# EAGLE design linistep1mod (EAGLE 6.4)

## Sheet 1 of 2
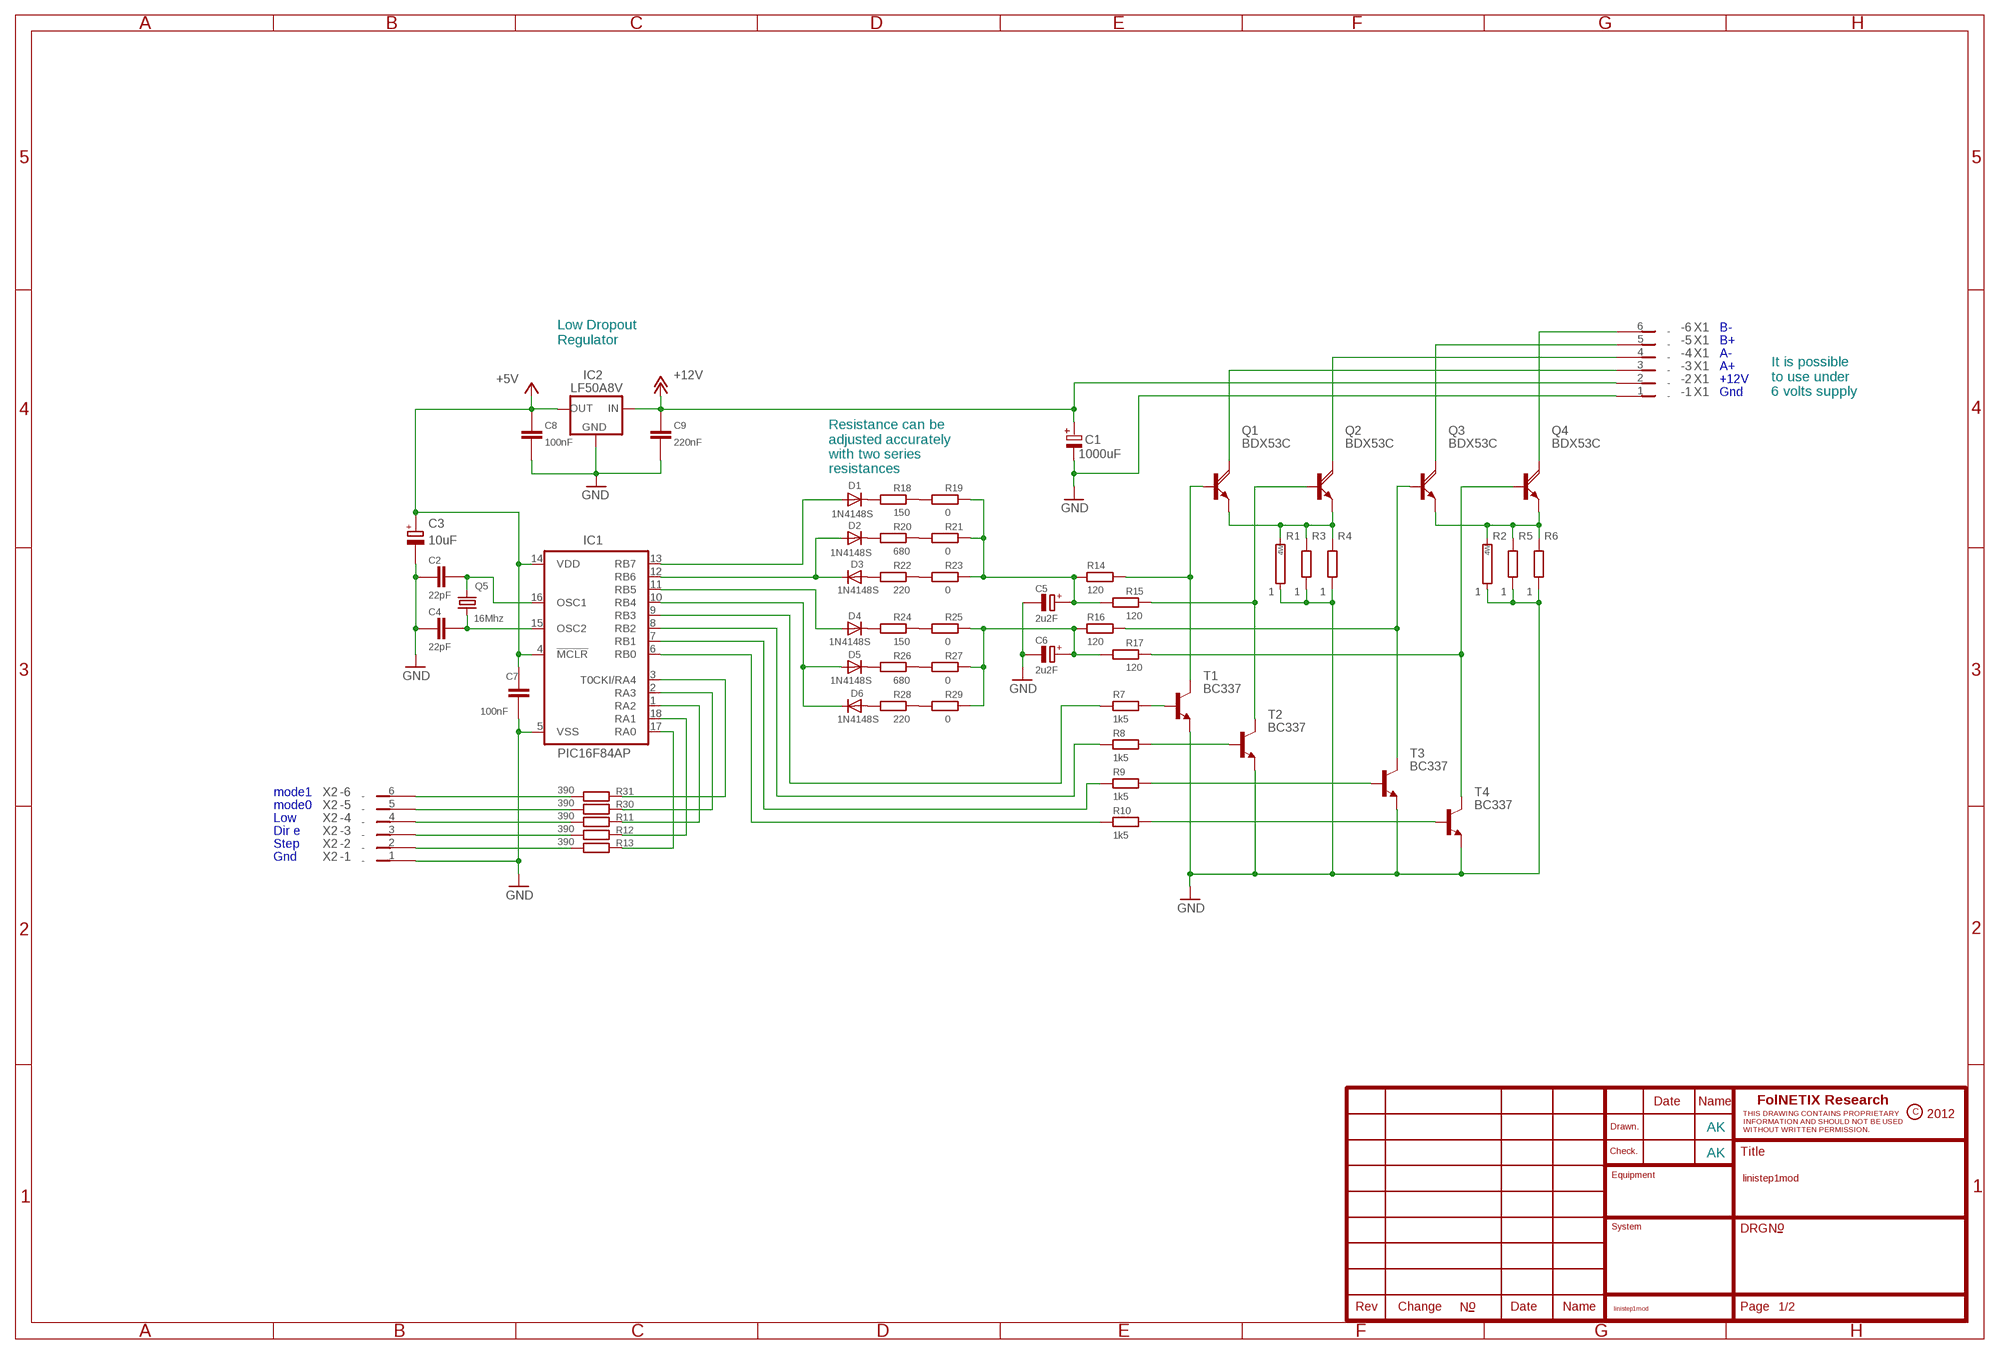
[diagram p0: schematic, sheet 1]

### Parts
C1  1000uF  E5-10,5  [E5-10,5]
C2  22pF  CAPACITOR_0805  [CAPC2012X145AN]
C3  10uF  POLARISED_B_CASE  [CAPMP3528X210N]
C4  22pF  CAPACITOR_0805  [CAPC2012X145AN]
C5  2u2F  POLARISED_A_CASE  [CAPMP3216X180N]
C6  2u2F  POLARISED_A_CASE  [CAPMP3216X180N]
C7  100nF  CAPACITOR_0805  [CAPC2012X145AN]
C8  100nF  CAPACITOR_0805  [CAPC2012X145AN]
C9  220nF  CAPACITOR_1210  [CAPC3225X168N]
D1  1N4148S  [DO35-7A]
D2  1N4148S  [DO35-7A]
D3  1N4148S  [DO35-7A]
D4  1N4148S  [DO35-7A]
D5  1N4148S  [DO35-7A]
D6  1N4148S  [DO35-7A]
IC1  PIC16F84AP  [DIL18]
IC2  LF50A8V  78XXL  [78XXL]
Q1  BDX53C  TIP120S  [TO220AHS]
Q2  BDX53C  TIP120S  [TO220AHS]
Q3  BDX53C  TIP120S  [TO220AHS]
Q4  BDX53C  TIP120S  [TO220AHS]
Q5  16Mhz  HC49/S  [HC49/S]
R1  1  206A  [206A]
R2  1  206A  [206A]
R3  1  0411/12  [0411/12]
R4  1  0411/12  [0411/12]
R5  1  0411/12  [0411/12]
R6  1  0411/12  [0411/12]
R7  1k5  RESISTOR_1206  [RESC3115X70N]
R8  1k5  RESISTOR_1206  [RESC3115X70N]
R9  1k5  RESISTOR_1206  [RESC3115X70N]
R10  1k5  RESISTOR_1206  [RESC3115X70N]
R11  390  RESISTOR_1206  [RESC3115X70N]
R12  390  RESISTOR_1206  [RESC3115X70N]
R13  390  RESISTOR_1206  [RESC3115X70N]
R14  120  RESISTOR_1206  [RESC3115X70N]
R15  120  RESISTOR_1206  [RESC3115X70N]
R16  120  RESISTOR_1206  [RESC3115X70N]
R17  120  RESISTOR_1206  [RESC3115X70N]
R18  150  RESISTOR_1206  [RESC3115X70N]
R19  0  RESISTOR_1206  [RESC3115X70N]
R20  680  RESISTOR_1206  [RESC3115X70N]
R21  0  RESISTOR_1206  [RESC3115X70N]
R22  220  RESISTOR_1206  [RESC3115X70N]
R23  0  RESISTOR_1206  [RESC3115X70N]
R24  150  RESISTOR_1206  [RESC3115X70N]
R25  0  RESISTOR_1206  [RESC3115X70N]
R26  680  RESISTOR_1206  [RESC3115X70N]
R27  0  RESISTOR_1206  [RESC3115X70N]
R28  220  RESISTOR_1206  [RESC3115X70N]
R29  0  RESISTOR_1206  [RESC3115X70N]
R30  390  RESISTOR_1206  [RESC3115X70N]
R31  390  RESISTOR_1206  [RESC3115X70N]
T1  BC337  [TO92]
T2  BC337  [TO92]
T3  BC337  [TO92]
T4  BC337  [TO92]
X1  RIACON-6  [RIACON-6]
X2  RIACON-6  [RIACON-6]

### Nets
+5V [power]: C3.+ C7.2 C8.2 IC1.4(!MCLR) IC1.14(VDD) IC2.OUT
+12V [power]: C1.+ C9.2 IC2.IN X1.2
GND [power]: C1.- C2.1 C3.- C4.1 C5.- C6.- C7.1 C8.1 C9.1 IC1.5(VSS) IC2.GND R1.1 R2.1 R3.1 R4.1 R5.1 R6.1 T1.1(E) T2.1(E) T3.1(E) T4.1(E) X1.1 X2.1
N$1 [power]: Q1.E Q2.E R1.2 R3.2 R4.2
N$2: D3.A R22.1
N$3: D2.C R20.1
N$4 [digital]: R7.2 T1.2(B)
N$5 [power]: Q3.E Q4.E R2.2 R5.2 R6.2
N$6 [digital]: R8.2 T2.2(B)
N$7: R31.1 X2.6
N$8 [digital]: R9.2 T3.2(B)
N$9 [digital]: Q4.B R17.2 T4.3(C)
N$10 [digital]: Q3.B R16.2 T3.3(C)
N$11 [digital]: Q2.B R15.2 T2.3(C)
N$12 [digital]: Q1.B R14.2 T1.3(C)
N$13 [digital]: R10.2 T4.2(B)
N$14 [power]: Q4.C X1.6
N$15 [power]: Q3.C X1.5
N$16 [power]: Q2.C X1.4
N$17 [power]: Q1.C X1.3
N$18: D1.C R18.1
N$19: D4.C R24.1
N$20: R30.1 X2.5
N$21: R18.2 R19.1
N$22: R20.2 R21.1
N$23: R22.2 R23.1
N$24: R24.2 R25.1
N$25: D5.C R26.1
N$26: D6.A R28.1
N$27 [digital]: C6.+ R16.1 R17.1 R25.2 R27.2 R29.2
N$28 [digital]: C5.+ R14.1 R15.1 R19.2 R21.2 R23.2
N$29: R26.2 R27.1
N$30: R28.2 R29.1
N$31: R11.1 X2.4
N$32 [digital]: D5.A D6.C IC1.10(RB4)
N$33: C2.2 IC1.16(OSC1) Q5.2
N$34: R12.1 X2.3
N$35: R13.1 X2.2
N$37 [digital]: IC1.6(RB0) R10.1
N$38 [digital]: IC1.7(RB1) R9.1
N$39 [digital]: IC1.8(RB2) R8.1
N$40 [digital]: IC1.9(RB3) R7.1
N$41 [digital]: D4.A IC1.11(RB5)
N$42: C4.2 IC1.15(OSC2) Q5.1
N$43 [power]: D1.A IC1.13(RB7)
N$44 [digital]: IC1.3(T0CKI/RA4) R31.2
N$45 [digital]: IC1.2(RA3) R30.2
N$46 [digital]: IC1.1(RA2) R11.2
N$47 [digital]: IC1.18(RA1) R12.2
N$48 [digital]: IC1.17(RA0) R13.2
N$50 [digital]: D2.A D3.C IC1.12(RB6)

### Notes on the sheet
- B-
- Low Dropout
  Regulator
- B+
- A-
- A+
- +12V
- Gnd
- It is possible
  to use under
  6 volts supply
- Resistance can be
  adjusted accurately
  with two series
  resistances
- mode1
- mode0
- Low
- Dir e
- Step
- Gnd
- AK
- AK

## Sheet 2 of 2
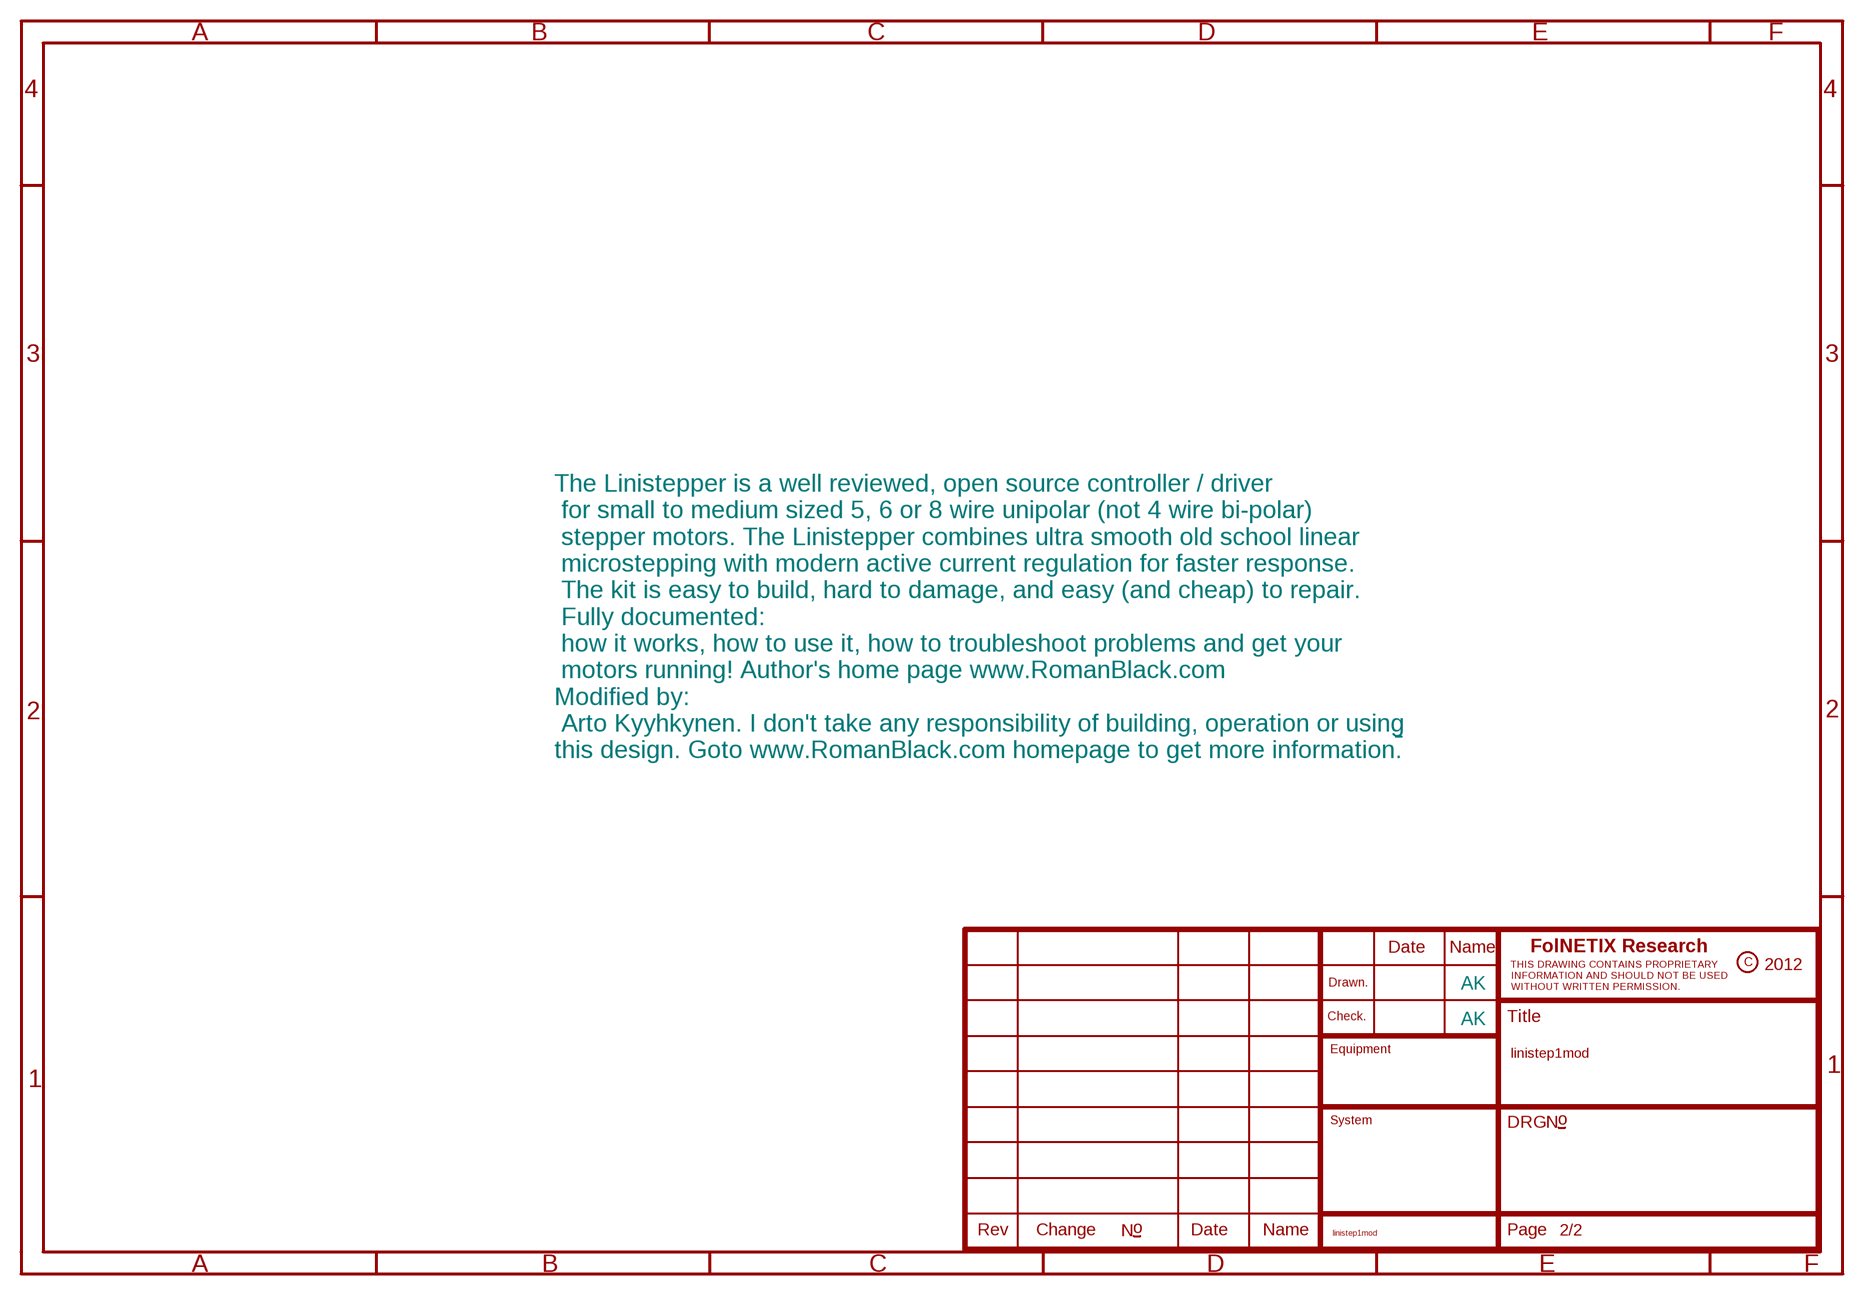
[diagram p1: schematic, sheet 2]

### Notes on the sheet
- The Linistepper is a well reviewed, open source controller / driver
   for small to medium sized 5, 6 or 8 wire unipolar (not 4 wire bi-polar)
   stepper motors. The Linistepper combines ultra smooth old school linear
   microstepping with modern active current regulation for faster response.
   The kit is easy to build, hard to damage, and easy (and cheap) to repair.
   Fully documented:
   how it works, how to use it, how to troubleshoot problems and get your
   motors running! Author's home page www.RomanBlack.com
  Modified by:
   Arto Kyyhkynen. I don't take any responsibility of building, operation or using
  this design. Goto www.RomanBlack.com homepage to get more information!.
- AK
- AK

## Library data of the parts
C1 = polcap:E5-10,5
C2 C4 C7-C9 = ipc-7351-capacitor:CAPACITOR_
C3 C5 C6 = ipc-7351-capacitor:POLARISED_
D1-D6 = diode:1N4148: DIODE high speed (Philips)
IC1 = microchip2:PIC16F8*: MICROCONTROLLER 8-Bit PIC16F8X Family - CMOS Flash/EEPROM Pin Compatible : PIC16F83, PIC16CR83, PIC16F84A, PIC16CR84 see also PIC16C*
IC2 = v-reg-2:78XXL: VOLTAGE REGULATOR
Q1-Q4 = user1:TIP120: NPN DARLINGTON TRANSISTOR
Q5 = quartz:HC49/S
R1 R2 = r-pwr:206A
R3-R6 = Resistor:0411/12
R7-R31 = ipc-7351-resistor:RESISTOR_
T1-T4 = transistor:BC337: NPN TRANSISTOR
X1 X2 = con-riacon2:RIACON-6

## Net classes
1 digital: width 0.254 mm, drill 1.016 mm, clearance 0.254 mm
2 power: width 1.016 mm, drill 1.016 mm, clearance 0.508 mm

## Board
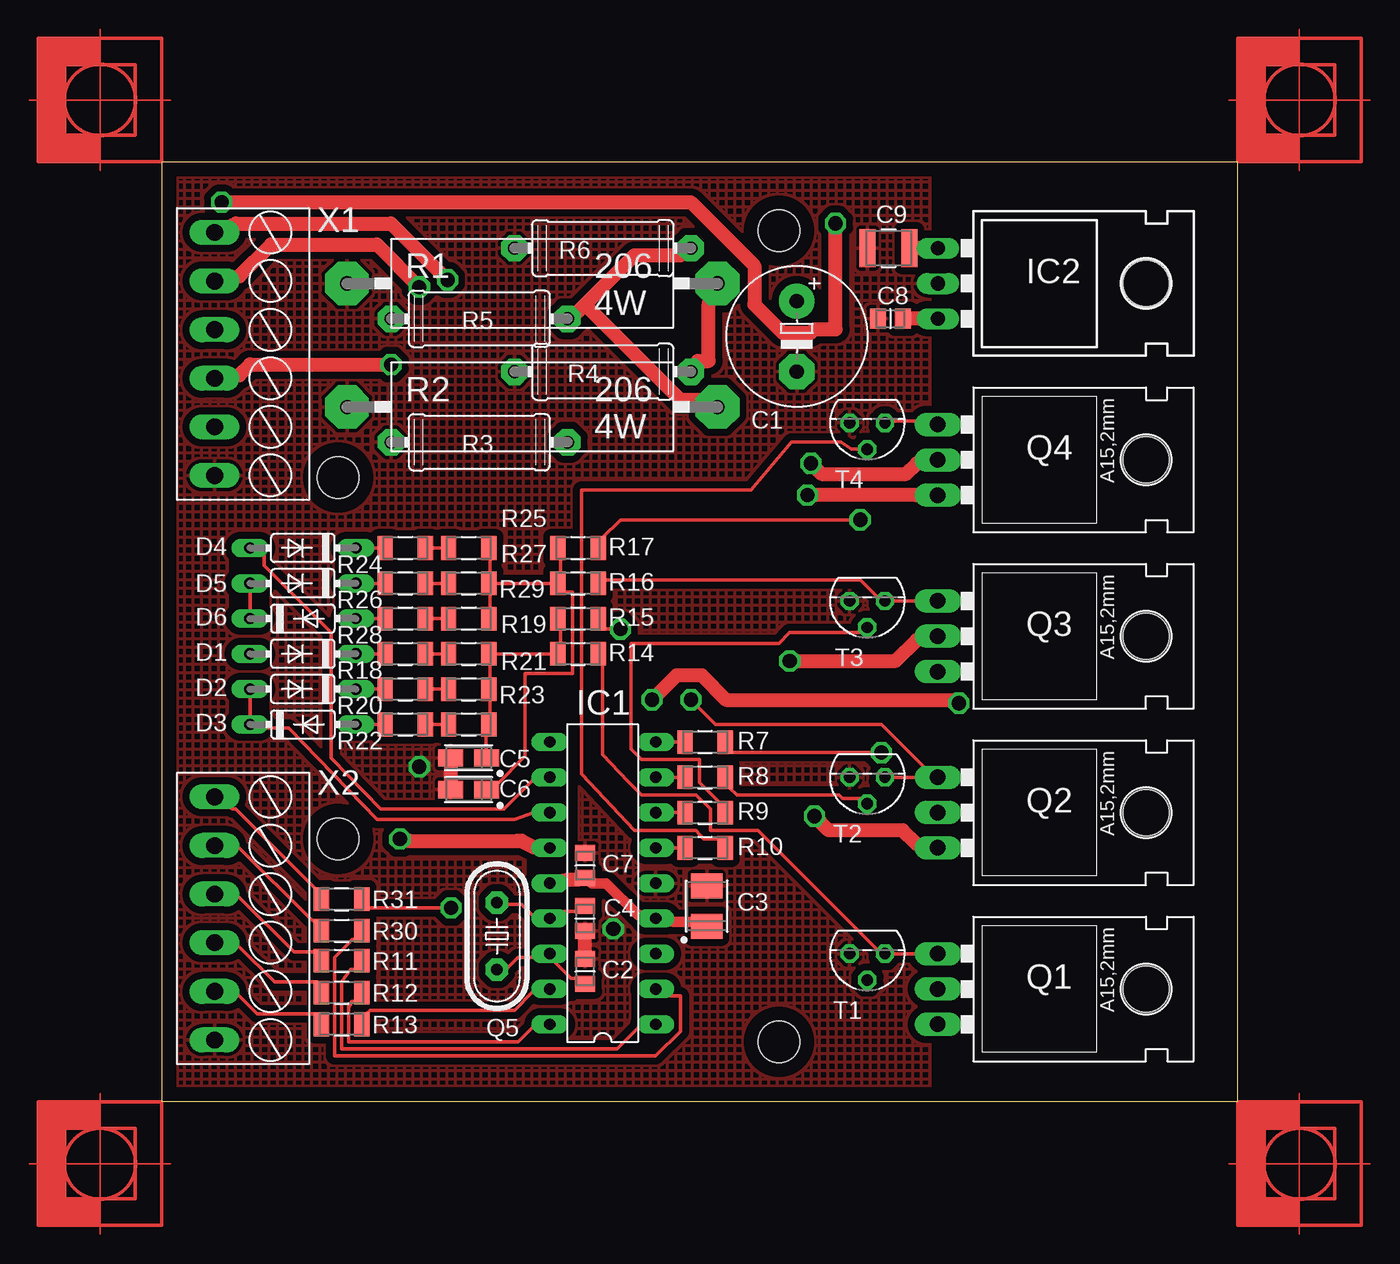
[diagram p2: board, top side]
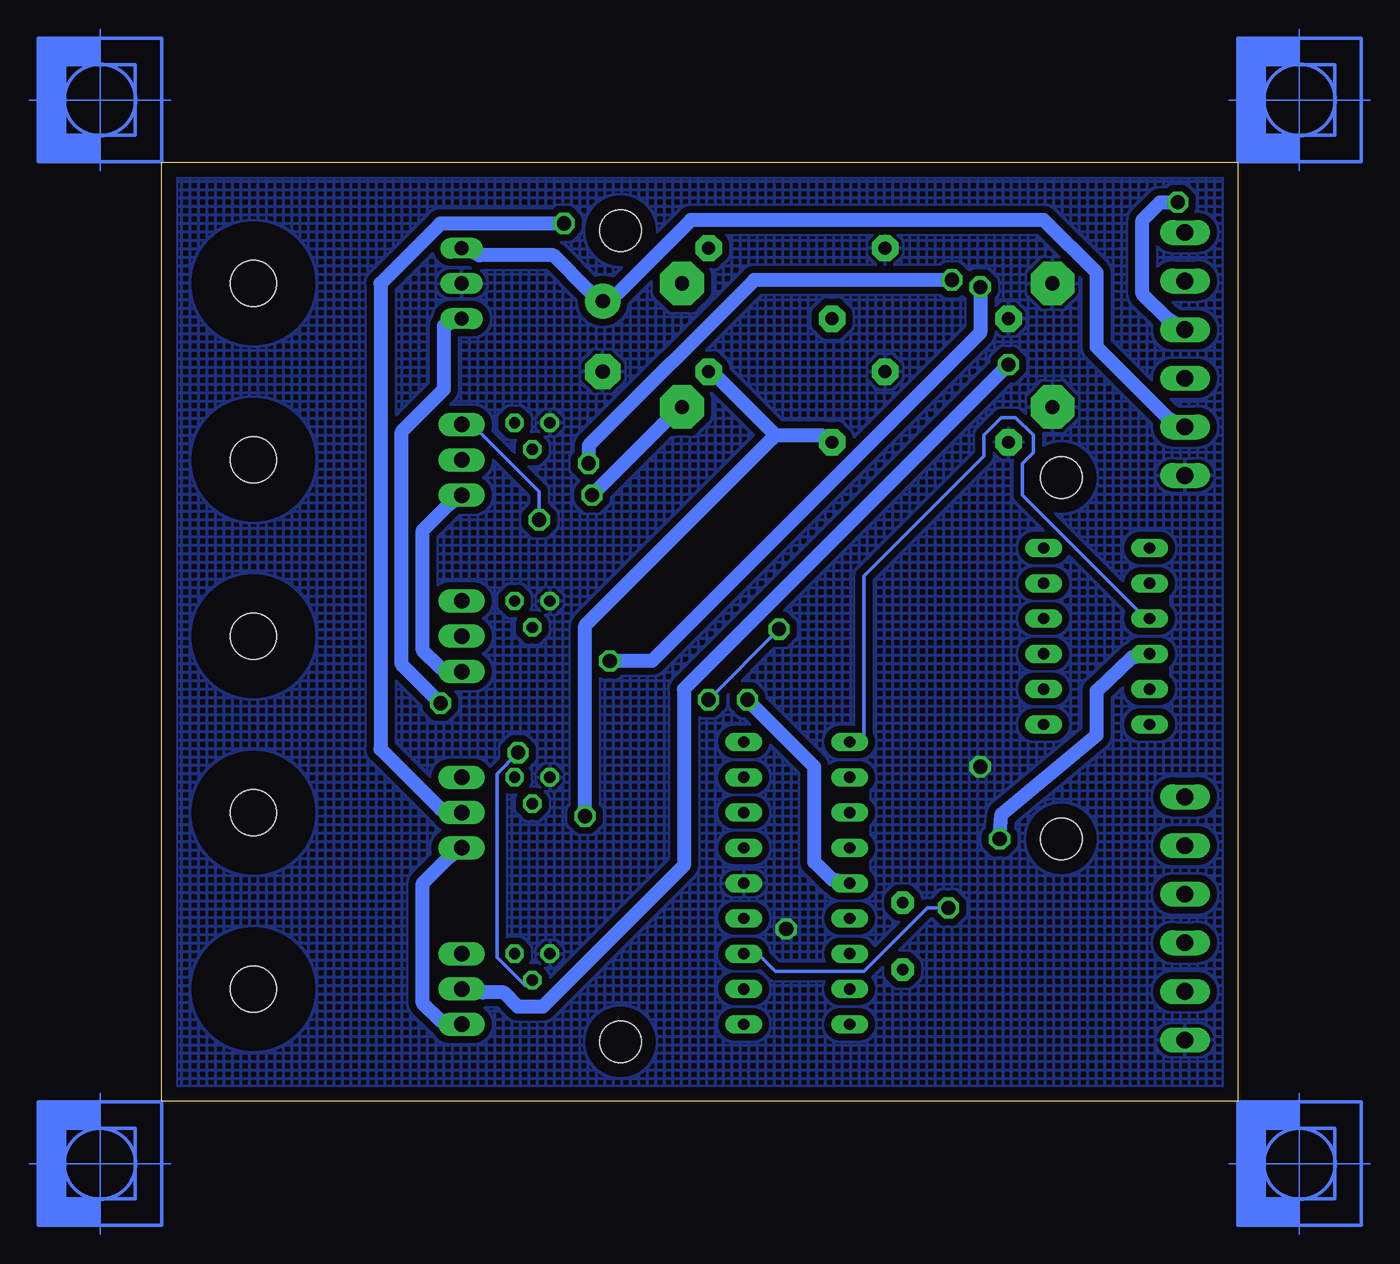
[diagram p3: board, bottom side, seen from below]

Size 77.45 x 67.61 mm. Coordinates in mm from the lower left corner, seen from the top.
Outline: 0,0 77.45,0 77.45,67.61 0,67.61 0,0
Copper layers (1*16): Top 0.035mm / dielectric 1.5mm / Bottom 0.035mm
Design rules "default": minimum track width 10mil, minimum drill 24mil, track to track 8mil, track to pad 8mil, pad to pad 8mil, via to via 8mil, smd to smd 8mil, copper to edge 40mil, drill to drill 8mil, minimum pad ring 10mil, minimum via ring 8mil, stop-mask expansion 4mil, vias tented up to drill 0mil, thermal gap 10mil
Holes 3 mm at 12.7,18.88 44.45,4.28 44.45,62.7 12.7,44.92
tRestrict: area 55.9,1.1 to 76.8,66.5; area 26.7,7.6 to 29.6,23.5; area 34.4,5.3 to 36.4,7.6; area 21.6,22.7 to 22.9,24.7; area 29.2,37.4 to 30.2,40.6; area 5.5,27.5 to 7.1,29; area 5.5,34.8 to 7.1,39.2; area 13.1,34.6 to 14.7,39.3; area 21.5,26 to 22.9,40.5; area 12.3,11.8 to 13.5,15.2; area 16.8,26.4 to 18.2,40.5; area 38.3,17.7 to 39.6,19.9
bRestrict: area 5.6,34.8 to 7.2,37; area 5.6,29.8 to 7.2,31.6; area 27.2,16 to 29.1,22.9
vRestrict: area 58.4,1.1 to 76.8,66.5

### Footprints (pad centres in the part's own frame; a part is rotated, then mirrored left to right if it is on the bottom)
E5-10,5 = drill 1.016 pad 2.54: + -2.54,0 | drill 1.016 pad 2.54 octagon: - 2.54,0
CAPC2012X145AN = smd 1.15 x 1.45: 1 -0.9,0; 2 0.9,0
CAPMP3528X210N = smd 1.8 x 2.25: + -1.45,0; - 1.45,0
CAPMP3216X180N = smd 1.8 x 1.25: + -1.3,0; - 1.3,0
CAPC3225X168N = smd 1.15 x 2.7: 1 -1.5,0; 2 1.5,0
DO35-7A = drill 0.813 long: A 3.81,0; C -3.81,0
DIL18 = drill 0.813 long: 1 -10.16,-3.81; 2 -7.62,-3.81; 3 -5.08,-3.81; 4 -2.54,-3.81; 5 0,-3.81; 6 2.54,-3.81; 7 5.08,-3.81; 8 7.62,-3.81; 9 10.16,-3.81; 10 10.16,3.81; 11 7.62,3.81; 12 5.08,3.81; 13 2.54,3.81; 14 0,3.81; 15 -2.54,3.81; 16 -5.08,3.81; 17 -7.62,3.81; 18 -10.16,3.81
78XXL = drill 1.016 long: GND 0,-3.81; IN -2.54,-3.81; OUT 2.54,-3.81 | hole 3.302: 0,11.176
TO220AHS = drill 1.118 long: B -2.54,-3.81; C 0,-3.81; E 2.54,-3.81 | hole 3.302: 0,11.176
HC49/S = drill 0.813 pad 1.6 octagon: 1 -2.413,0; 2 2.413,0
206A = drill 1.016 pad 3.15 octagon: 1 -13.335,0; 2 13.335,0
0411/12 = drill 0.914 pad 1.905 octagon: 1 -6.35,0; 2 6.35,0
RESC3115X70N = smd 1.1 x 1.7: 1 -1.45,0; 2 1.45,0
TO92 = drill 0.813 octagon: 1 1.27,0; 2 0,1.905; 3 -1.27,0
RIACON-6 = drill 1.2 long: 1 0,8.75; 2 0,5.25; 3 0,1.75; 4 0,-1.75; 5 0,-5.25; 6 0,-8.75

### Placement (x,y rotation side)
C1  45.71,55.08 270 top
C2  30.47,9.36 270 top
C3  39.24,14.06 90 top
C4  30.47,13.17 90 top
C5  22.09,24.73 180 top
C6  22.09,22.44 180 top
C7  30.47,16.98 270 top
C8  52.45,56.35 0 top
C9  52.32,61.43 0 top
D1  10.16,32.22 180 top
D2  10.16,29.68 180 top
D3  10.16,27.14 0 top
D4  10.16,39.84 180 top
D5  10.16,37.3 180 top
D6  10.16,34.76 0 top
IC1  31.75,15.71 90 top
IC2  59.69,58.89 270 top
Q1  59.69,8.09 270 top
Q2  59.69,20.79 270 top
Q3  59.69,33.49 270 top
Q4  59.69,46.19 270 top
Q5  24.12,11.9 270 top
R1  26.66,58.89 0 top
R2  26.66,50 0 top
R3  22.86,47.46 0 top
R4  31.75,52.54 0 top
R5  22.86,56.35 0 top
R6  31.75,61.43 0 top
R7  39.11,25.87 0 top
R8  39.11,23.33 0 top
R9  39.11,20.79 0 top
R10  39.11,18.25 0 top
R11  12.95,10.12 0 top
R12  12.95,7.84 0 top
R13  12.95,5.55 0 top
R14  29.97,32.22 0 top
R15  29.97,34.76 0 top
R16  29.97,37.3 0 top
R17  29.97,39.84 0 top
R18  17.52,32.22 0 top
R19  22.09,32.22 0 top
R20  17.52,29.68 0 top
R21  22.09,29.68 0 top
R22  17.52,27.14 0 top
R23  22.09,27.14 0 top
R24  17.52,39.84 0 top
R25  22.09,39.84 0 top
R26  17.52,37.3 0 top
R27  22.09,37.3 0 top
R28  17.52,34.76 0 top
R29  22.09,34.76 0 top
R30  12.95,12.28 0 top
R31  12.95,14.57 0 top
T1  50.79,10.63 180 top
T2  50.79,23.33 180 top
T3  50.79,36.03 180 top
T4  50.79,48.86 180 top
U$2  [PASSMARK]  -4.45,-4.48 0 top  (outside the outline)
U$3  [PASSMARK]  -4.45,72.1 0 top  (outside the outline)
U$4  [PASSMARK]  81.91,72.1 0 top  (outside the outline)
U$5  [PASSMARK]  81.91,-4.48 0 top  (outside the outline)
X1  3.81,53.81 180 top
X2  3.81,13.17 180 top

### Tracks (layer width: path | path; a pad name or v marks a point on that pad's centre or on a via)
+5V  (via drill 1.02)
  Top 0.762: C3.+ 38.35,12.92 36.82,12.92 IC1.4 34.28,13.42 32,15.71 30.98,15.71 C7.2
  Top 1.016: C8.2 53.84,56.35 54.6,56.35 IC2.OUT | C7.2 29.97,15.96 29.21,15.96 IC1.14 | v57.4,28.66 57.14,28.92 40.63,28.92 38.86,30.7 37.08,30.7 v35.3,28.92
  Bottom 1.016: v57.4,28.66 60.19,31.46 60.19,48.22 57.14,51.27 57.14,55.84 IC2.OUT | v35.3,28.92 30.47,24.09 30.47,17.23 29.21,15.96 IC1.14
+12V
  Top 1.016: C9.2 54.1,61.43 54.6,61.43 IC2.IN
  Bottom 1.016: X1.2 5.08,49.24 10.16,54.32 10.16,59.65 13.96,63.46 39.36,63.46 44.7,58.13 C1.+ 46.73,58.38 49.27,60.92 54.6,60.92 IC2.IN
GND  (via drill 1.02)
  Top 1.016: C2.1 C4.1 | C6.- 20.82,22.82 20.82,24.35 C5.-
  other vias: 32.51,12.41 18.54,24.09
  pour Top (isolate 0.254, hatched): 0.63,66.51 76.83,66.51 76.83,1.11 0.63,1.11
  pour Bottom (isolate 0.254, hatched): 0.63,66.51 76.83,66.51 76.83,1.11 0.63,1.11
N$1  (via drill 1.02)
  Top 1.016: R1.2 39.36,57.37 39.36,53.3 38.6,53.3 R4.2 | v46.98,20.54 48,19.52 53.33,19.52 54.35,18.5 Q2.E
  Bottom 1.016: Q1.E 57.4,5.8 58.67,7.07 58.67,15.71 56.89,17.49 Q2.E | 33.27,47.97 29.97,47.97 R3.2 | 33.27,47.97 37.33,52.03 R4.2 | v46.98,20.54 46.98,34.25 33.52,47.71 33.27,47.97
N$2
  Top 0.254: R22.1 15.74,27.14 15.23,27.14 D3.A
N$3
  Top 0.254: R20.1 15.74,29.68 15.23,29.68 D2.C
N$4  (via drill 1.02)
  Top 0.254: v51.81,25.11 40.89,25.11 R7.2
  Bottom 0.254: v51.81,25.11 53.33,23.58 53.33,10.38 51.3,8.34 T1.2
N$5  (via drill 1.02)
  Top 1.016: 30.47,57.37 34.03,60.92 37.33,60.92 R6.2 | 30.47,57.37 29.97,56.86 R5.2 | R2.2 38.6,50.51 37.33,50.51 30.73,57.11 30.47,57.37 | v46.48,43.65 54.35,43.65 Q4.E
  Bottom 1.016: Q3.E 57.4,31.2 58.67,32.47 58.67,41.11 56.89,42.89 Q4.E | v46.48,43.65 41.14,48.98 R2.2
N$6
  Top 0.254: R8.2 40.89,22.57 41.4,22.06 48.76,22.06 49.02,21.81 50.29,21.81 T2.2
N$7
  Top 0.254: R31.1 11.17,15.2 5.33,21.04 5.08,21.04 X2.6
N$8
  Top 0.254: R9.2 40.13,21.55 38.73,22.95 38.73,24.6 34.54,24.6 33.78,25.36 33.78,32.98 44.45,32.98 45.21,33.74 50.29,33.74 T3.2
N$9  (via drill 1.02)
  Top 0.254: v50.29,41.87 33.02,41.87 31.75,40.6 R17.2 | T4.3 52.57,48.98 54.35,48.98 Q4.B
  Bottom 0.254: v50.29,41.87 50.29,43.9 54.6,48.22 Q4.B
N$10
  Top 0.254: R16.2 31.75,37.55 50.29,37.55 51.56,36.28 T3.3 52.57,36.03 54.35,36.03 Q3.B
N$11  (via drill 1.02)
  Top 0.254: v33.02,34 31.75,34 R15.2 | v38.09,28.92 39.87,27.14 51.81,27.14 54.86,24.09 Q2.B 54.35,23.33 52.57,23.33 T2.3
  Bottom 0.254: v33.02,34 v38.09,28.92
N$12
  Top 0.254: R14.2 31.75,31.46 31.75,24.98 33.52,23.08 34.54,22.06 38.48,22.06 39.49,21.04 39.49,19.52 42.92,19.52 51.56,10.88 T1.3 52.57,10.63 54.35,10.63 Q1.B
N$13
  Top 0.254: R10.2 40.13,18.88 38.98,18.88 38.48,19.52 34.03,19.52 30.22,23.58 30.22,44.03 42.41,44.03 45.33,47.46 48.89,47.46 49.65,46.95 50.54,46.95 T4.2
N$14  (via drill 1.02)
  Top 1.016: v46.73,45.94 47.49,45.17 53.59,45.17 54.35,45.94 Q4.C | v20.57,59.14 16.5,63.21 5.33,63.21 X1.6
  Bottom 1.016: v46.73,45.94 46.73,47.21 34.79,59.14 v20.57,59.14
N$15  (via drill 1.02)
  Top 1.016: v45.21,31.71 52.83,31.71 54.35,33.24 Q3.C | v18.54,58.64 15.49,61.68 7.87,61.68 5.58,59.4 X1.5
  Bottom 1.016: v45.21,31.71 42.16,31.71 18.54,55.33 v18.54,58.64
N$16  (via drill 1.02)
  Top 1.016: v48.51,63.21 48.51,55.59 46.98,55.59 46.73,55.33 44.7,55.33 42.67,57.37 42.67,60.16 38.09,64.73 v4.31,64.73
  Bottom 1.016: v48.51,63.21 57.4,63.21 61.72,58.89 61.72,25.36 57.4,21.04 Q2.C | v4.31,64.73 5.58,64.73 6.85,63.46 6.85,58.13 5.08,56.35 X1.4
N$17  (via drill 1.02)
  Top 1.016: v16.5,53.05 6.34,53.05 5.58,52.29 X1.3
  Bottom 1.016: v16.5,53.05 39.87,29.68 39.87,16.98 50.03,6.82 51.81,6.82 52.83,7.84 54.35,7.84 Q1.C
N$18
  Top 0.254: R18.1 15.74,32.22 15.23,32.22 D1.C
N$19
  Top 0.254: R24.1 15.74,39.84 15.23,39.84 D4.C
N$20
  Top 0.254: R30.1 11.17,12.92 11.17,12.79 10.66,13.17 5.58,18.25 X2.5
N$21
  Top 0.254: R18.2 19.3,32.22 20.32,32.22 R19.1
N$22
  Top 0.254: R20.2 19.3,29.68 20.32,29.68 R21.1
N$23
  Top 0.254: R22.2 19.3,27.14 20.32,27.14 R23.1
N$24
  Top 0.254: R24.2 19.3,39.84 20.32,39.84 R25.1
N$25
  Top 0.254: R26.1 15.74,37.3 15.23,37.3 D5.C
N$26
  Top 0.254: R28.1 15.74,34.76 15.23,34.76 D6.A
N$27
  Top 0.254: R29.2 23.62,35.52 23.62,36.54 R27.2 | R25.2 23.62,39.08 23.62,38.06 R27.2 | R16.1 28.7,38.06 28.7,39.08 R17.1 | C6.+ 24.12,22.82 26.16,24.85 26.16,30.82 29.59,30.82 29.59,36.67 28.95,36.67 R16.1 | R27.2 23.87,37.3 28.19,37.3 R16.1
N$28
  Top 0.254: R15.1 28.7,34 28.7,32.98 R14.1 28.19,32.22 23.87,32.22 R19.2 23.62,31.46 23.62,30.44 R21.2 23.62,28.92 23.62,27.9 R23.2 23.36,26.38 23.36,25.11 C5.+
N$29
  Top 0.254: R26.2 19.3,37.3 20.32,37.3 R27.1
N$30
  Top 0.254: R28.2 19.3,34.76 20.32,34.76 R29.1
N$31
  Top 0.254: R11.1 11.17,10.76 9.52,10.76 5.58,14.69 X2.4
N$32
  Top 0.254: D6.C 6.34,35.27 6.34,36.79 D5.A
  Bottom 0.254: IC1.10 26.92,26.38 26.92,37.81 18.28,46.44 18.28,47.97 17.01,49.24 16,49.24 14.73,47.97 14.73,46.7 15.49,45.94 15.49,43.65 7.11,35.27 D6.C
N$33
  Top 0.254: C2.2 29.97,8.85 29.46,8.85 28.19,10.12 IC1.16 26.66,10.38 25.65,10.38 24.89,9.61 Q5.2
N$34
  Top 0.254: R12.1 11.17,8.6 10.92,8.6 8.12,8.6 5.58,11.14 X2.3
N$35
  Top 0.254: R13.1 11.17,6.31 10.92,6.31 6.85,6.31 5.58,7.58 X2.2
N$37
  Top 0.254: R10.1 37.33,18.25 36.82,18.25 IC1.6
N$38
  Top 0.254: R9.1 37.33,20.79 36.82,20.79 IC1.7
N$39
  Top 0.254: R8.1 37.33,23.33 36.82,23.33 IC1.8
N$40
  Top 0.254: R7.1 37.33,25.87 36.82,25.87 IC1.9
N$41
  Top 0.254: D4.A 7.36,39.33 7.36,38.57 12.19,33.74 12.19,24.73 15.74,21.04 19.55,21.04 24.63,21.04 26.66,23.08 IC1.11
N$42
  Top 0.254: C4.2 29.97,13.68 28.95,13.68 IC1.15 26.66,13.42 25.9,14.19 24.89,14.19 Q5.1
N$43  (via drill 1.02)
  Top 1.016: v17.14,18.88 17.78,18.76 25.65,18.76 25.9,18.76 26.92,18.25 IC1.13
  Bottom 1.016: v17.14,18.88 17.01,20.66 10.16,26.38 10.16,29.55 7.61,31.97 D1.A
N$44  (via drill 1.02)
  Top 0.254: v20.82,13.93 14.73,13.93 R31.2
  Bottom 0.254: v20.82,13.93 22.35,13.93 26.92,9.36 33.27,9.36 34.28,10.38 IC1.3
N$45
  Top 0.254: R30.2 13.96,11.65 13.71,11.65 13.46,11.39 12.44,10.38 12.44,3.26 35.55,3.26 37.33,5.04 37.33,7.58 36.57,7.58 IC1.2
N$46
  Top 0.254: R11.2 13.96,9.49 13.71,9.49 13.58,9.49 12.95,8.6 12.95,3.77 32.76,3.77 34.28,5.3 IC1.1
N$47
  Top 0.254: R12.2 13.96,7.2 13.71,7.2 13.46,6.82 13.46,4.28 25.65,4.28 26.66,5.3 IC1.18
N$48
  Top 0.254: R13.2 14.73,6.31 14.98,6.57 25.39,6.57 26.66,7.84 IC1.17
N$49
  Top 0.254: 40.13,21.55 40.13,20.28 40.54,20.79
N$50
  Top 0.254: D2.A 6.34,29.17 6.34,27.65 D3.C 7.61,26.89 9.14,26.89 15.49,20.28 25.39,20.28 26.79,20.79 IC1.12